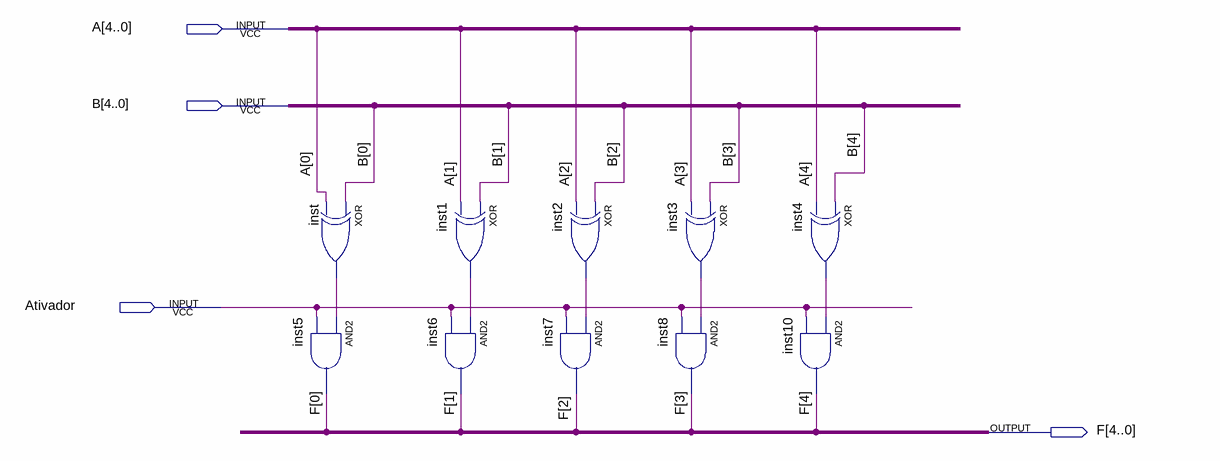
[diagram p0: schematic sheet]
// Quartus schematic AxorB.bdf as structural Verilog: 10 symbols, 4 pins
module AxorB (
  input  [4:0] A,
  input  [4:0] B,
  input  Ativador,
  output [4:0] F
);

  wire inst1_out, inst2_out, inst3_out, inst4_out, inst_out;

  xor inst (inst_out, B[0], A[0]);
  and inst5 (F[0], inst_out, Ativador);
  xor inst1 (inst1_out, B[1], A[1]);
  and inst6 (F[1], inst1_out, Ativador);
  xor inst2 (inst2_out, B[2], A[2]);
  and inst7 (F[2], inst2_out, Ativador);
  xor inst3 (inst3_out, B[3], A[3]);
  and inst8 (F[3], inst3_out, Ativador);
  xor inst4 (inst4_out, B[4], A[4]);
  and inst10 (F[4], inst4_out, Ativador);
endmodule
